# Altium schematic sheet 14 CPU_2.SchDoc
size 420 x 297 mm; Address1: Address1; Address2: Address2; Address3: Address3; Address4: Address4; DocumentNumber: АБВГ.123456.001 Э3; SheetNumber: 14; SheetTotal: 23; Scale: 1:1; DocumentType: Схема электрическая принципиальная; FirstReferrence: АБВГ.123456.001
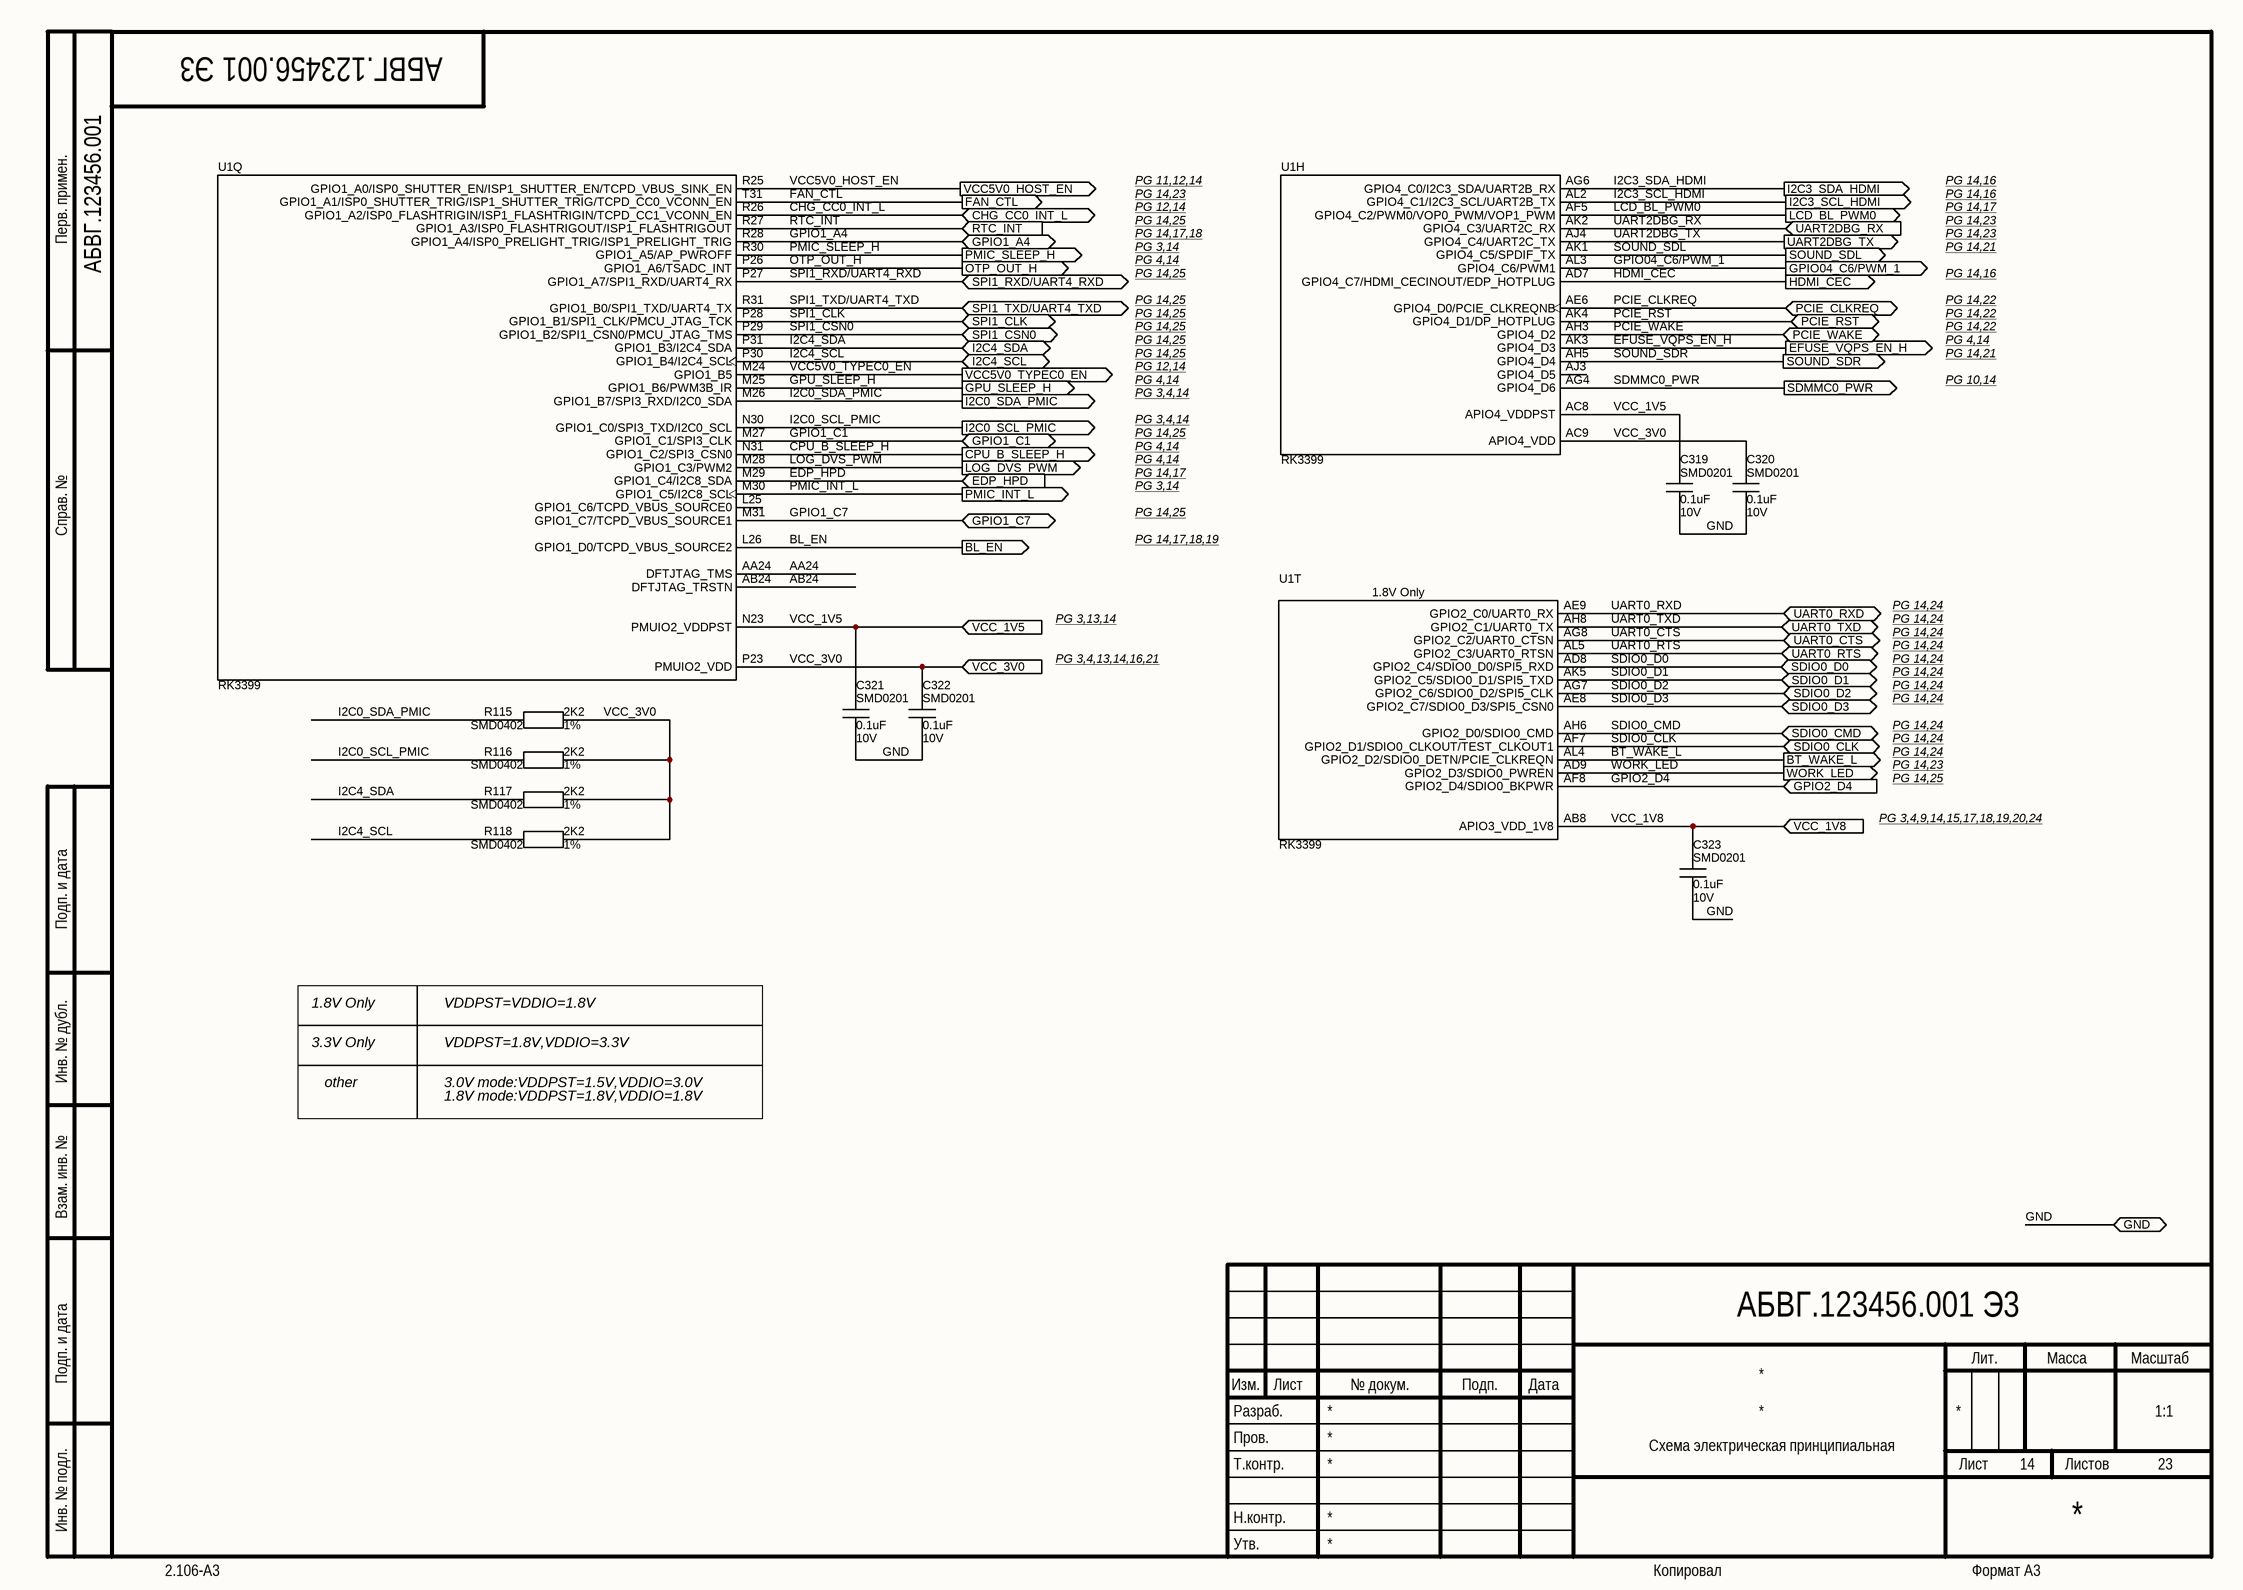
[diagram p0: 14 CPU_2.SchDoc]

## Parts
C319  Package: SMD0201  Voltage: 10V  [CAP_SMD_0201]  (hidden comment: 0.1uF)
C320  Package: SMD0201  Voltage: 10V  [CAP_SMD_0201]  (hidden comment: 0.1uF)
C321  Package: SMD0201  Voltage: 10V  [CAP_SMD_0201]  (hidden comment: 0.1uF)
C322  Package: SMD0201  Voltage: 10V  [CAP_SMD_0201]  (hidden comment: 0.1uF)
C323  Package: SMD0201  Voltage: 10V  [CAP_SMD_0201]  (hidden comment: 0.1uF)
R115  Package: SMD0402  Tolerance: 1%  [RES_SMD_0402]  (hidden comment: 2K2)
R116  Package: SMD0402  Tolerance: 1%  [RES_SMD_0402]  (hidden comment: 2K2)
R117  Package: SMD0402  Tolerance: 1%  [RES_SMD_0402]  (hidden comment: 2K2)
R118  Package: SMD0402  Tolerance: 1%  [RES_SMD_0402]  (hidden comment: 2K2)
U1  value RK3399  [BGA828C65P31X31_2100X2100X161N]  (hidden comment: RK3399_FF)  (parts H,Q,T of 23)

## Ports
BL_EN (out), BT_WAKE_L (out), CHG_CC0_INT_L (bidir), CPU_B_SLEEP_H (out), EDP_HPD (in), EFUSE_VQPS_EN_H (out), FAN_CTL (out), GND (bidir), GPIO1_A4 (bidir), GPIO1_C1 (bidir), GPIO1_C7 (bidir), GPIO2_D4 (in), GPIO04_C6/PWM_1 (out), GPU_SLEEP_H (out), HDMI_CEC (out), I2C0_SCL_PMIC (out), I2C0_SDA_PMIC (out), I2C3_SCL_HDMI (out), I2C3_SDA_HDMI (out), I2C4_SCL (bidir), I2C4_SDA (bidir), LCD_BL_PWM0 (out), LOG_DVS_PWM (out), OTP_OUT_H (out), PCIE_CLKREQ (bidir), PCIE_RST (bidir), PCIE_WAKE (bidir), PMIC_INT_L (out), PMIC_SLEEP_H (out), RTC_INT (in), SDIO0_CLK (bidir), SDIO0_CMD (bidir), SDIO0_D0 (bidir), SDIO0_D1 (bidir), SDIO0_D2 (bidir), SDIO0_D3 (bidir), SDMMC0_PWR (out), SOUND_SDL (out), SOUND_SDR (out), SPI1_CLK (bidir), SPI1_CSN0 (bidir), SPI1_RXD/UART4_RXD (bidir), SPI1_TXD/UART4_TXD (bidir), UART0_CTS (bidir), UART0_RTS (bidir), UART0_RXD (bidir), UART0_TXD (bidir), UART2DBG_RX (in), UART2DBG_TX (out), VCC5V0_HOST_EN (out), VCC5V0_TYPEC0_EN (out), VCC_1V5 (in), VCC_1V8 (in), VCC_3V0 (in), WORK_LED (out)

## Nets
AA24: U1.AA24(DFTJTAG_TMS)
AB24: U1.AB24(DFTJTAG_TRSTN)
BL_EN: U1.L26(GPIO1_D0/TCPD_VBUS_SOURCE2) ; port BL_EN
BT_WAKE_L: U1.AL4(GPIO2_D2/SDIO0_DETN/PCIE_CLKREQN) ; port BT_WAKE_L
CHG_CC0_INT_L: U1.R26(GPIO1_A2/ISP0_FLASHTRIGIN/ISP1_FLASHTRIGIN/TCPD_CC1_VCONN_EN) ; port CHG_CC0_INT_L
CPU_B_SLEEP_H: U1.N31(GPIO1_C2/SPI3_CSN0) ; port CPU_B_SLEEP_H
EDP_HPD: U1.M29(GPIO1_C4/I2C8_SDA) ; port EDP_HPD
EFUSE_VQPS_EN_H: U1.AK3(GPIO4_D3) ; port EFUSE_VQPS_EN_H
FAN_CTL: U1.T31(GPIO1_A1/ISP0_SHUTTER_TRIG/ISP1_SHUTTER_TRIG/TCPD_CC0_VCONN_EN) ; port FAN_CTL
GND: C319.2 C320.2 C321.2 C322.2 C323.2 ; port GND
GPIO1_A4: U1.R28(GPIO1_A4/ISP0_PRELIGHT_TRIG/ISP1_PRELIGHT_TRIG) ; port GPIO1_A4
GPIO1_C1: U1.M27(GPIO1_C1/SPI3_CLK) ; port GPIO1_C1
GPIO1_C7: U1.M31(GPIO1_C7/TCPD_VBUS_SOURCE1) ; port GPIO1_C7
GPIO2_D4: U1.AF8(GPIO2_D4/SDIO0_BKPWR) ; port GPIO2_D4
GPIO04_C6/PWM_1: U1.AL3(GPIO4_C6/PWM1) ; port GPIO04_C6/PWM_1
GPU_SLEEP_H: U1.M25(GPIO1_B6/PWM3B_IR) ; port GPU_SLEEP_H
HDMI_CEC: U1.AD7(GPIO4_C7/HDMI_CECINOUT/EDP_HOTPLUG) ; port HDMI_CEC
I2C0_SCL_PMIC: R116.2 U1.N30(GPIO1_C0/SPI3_TXD/I2C0_SCL) ; port I2C0_SCL_PMIC
I2C0_SDA_PMIC: R115.2 U1.M26(GPIO1_B7/SPI3_RXD/I2C0_SDA) ; port I2C0_SDA_PMIC
I2C3_SCL_HDMI: U1.AL2(GPIO4_C1/I2C3_SCL/UART2B_TX) ; port I2C3_SCL_HDMI
I2C3_SDA_HDMI: U1.AG6(GPIO4_C0/I2C3_SDA/UART2B_RX) ; port I2C3_SDA_HDMI
I2C4_SCL: R118.2 U1.P30(GPIO1_B4/I2C4_SCL) ; port I2C4_SCL
I2C4_SDA: R117.2 U1.P31(GPIO1_B3/I2C4_SDA) ; port I2C4_SDA
LCD_BL_PWM0: U1.AF5(GPIO4_C2/PWM0/VOP0_PWM/VOP1_PWM) ; port LCD_BL_PWM0
LOG_DVS_PWM: U1.M28(GPIO1_C3/PWM2) ; port LOG_DVS_PWM
OTP_OUT_H: U1.P26(GPIO1_A6/TSADC_INT) ; port OTP_OUT_H
PCIE_CLKREQ: U1.AE6(GPIO4_D0/PCIE_CLKREQNB) ; port PCIE_CLKREQ
PCIE_RST: U1.AK4(GPIO4_D1/DP_HOTPLUG) ; port PCIE_RST
PCIE_WAKE: U1.AH3(GPIO4_D2) ; port PCIE_WAKE
PMIC_INT_L: U1.M30(GPIO1_C5/I2C8_SCL) ; port PMIC_INT_L
PMIC_SLEEP_H: U1.R30(GPIO1_A5/AP_PWROFF) ; port PMIC_SLEEP_H
RTC_INT: U1.R27(GPIO1_A3/ISP0_FLASHTRIGOUT/ISP1_FLASHTRIGOUT) ; port RTC_INT
SDIO0_CLK: U1.AF7(GPIO2_D1/SDIO0_CLKOUT/TEST_CLKOUT1) ; port SDIO0_CLK
SDIO0_CMD: U1.AH6(GPIO2_D0/SDIO0_CMD) ; port SDIO0_CMD
SDIO0_D0: U1.AD8(GPIO2_C4/SDIO0_D0/SPI5_RXD) ; port SDIO0_D0
SDIO0_D1: U1.AK5(GPIO2_C5/SDIO0_D1/SPI5_TXD) ; port SDIO0_D1
SDIO0_D2: U1.AG7(GPIO2_C6/SDIO0_D2/SPI5_CLK) ; port SDIO0_D2
SDIO0_D3: U1.AE8(GPIO2_C7/SDIO0_D3/SPI5_CSN0) ; port SDIO0_D3
SDMMC0_PWR: U1.AG4(GPIO4_D6) ; port SDMMC0_PWR
SOUND_SDL: U1.AK1(GPIO4_C5/SPDIF_TX) ; port SOUND_SDL
SOUND_SDR: U1.AH5(GPIO4_D4) ; port SOUND_SDR
SPI1_CLK: U1.P28(GPIO1_B1/SPI1_CLK/PMCU_JTAG_TCK) ; port SPI1_CLK
SPI1_CSN0: U1.P29(GPIO1_B2/SPI1_CSN0/PMCU_JTAG_TMS) ; port SPI1_CSN0
SPI1_RXD/UART4_RXD: U1.P27(GPIO1_A7/SPI1_RXD/UART4_RX) ; port SPI1_RXD/UART4_RXD
SPI1_TXD/UART4_TXD: U1.R31(GPIO1_B0/SPI1_TXD/UART4_TX) ; port SPI1_TXD/UART4_TXD
UART0_CTS: U1.AG8(GPIO2_C2/UART0_CTSN) ; port UART0_CTS
UART0_RTS: U1.AL5(GPIO2_C3/UART0_RTSN) ; port UART0_RTS
UART0_RXD: U1.AE9(GPIO2_C0/UART0_RX) ; port UART0_RXD
UART0_TXD: U1.AH8(GPIO2_C1/UART0_TX) ; port UART0_TXD
UART2DBG_RX: U1.AK2(GPIO4_C3/UART2C_RX) ; port UART2DBG_RX
UART2DBG_TX: U1.AJ4(GPIO4_C4/UART2C_TX) ; port UART2DBG_TX
VCC5V0_HOST_EN: U1.R25(GPIO1_A0/ISP0_SHUTTER_EN/ISP1_SHUTTER_EN/TCPD_VBUS_SINK_EN) ; port VCC5V0_HOST_EN
VCC5V0_TYPEC0_EN: U1.M24(GPIO1_B5) ; port VCC5V0_TYPEC0_EN
VCC_1V5: C319.1 C321.1 U1.AC8(APIO4_VDDPST) U1.N23(PMUIO2_VDDPST) ; port VCC_1V5
VCC_1V8: C323.1 U1.AB8(APIO3_VDD_1V8) ; port VCC_1V8
VCC_3V0: C320.1 C322.1 R115.1 R116.1 R117.1 R118.1 U1.AC9(APIO4_VDD) U1.P23(PMUIO2_VDD) ; port VCC_3V0
WORK_LED: U1.AD9(GPIO2_D3/SDIO0_PWREN) ; port WORK_LED

Not connected (* = marked no-connect by the designer): U1 AJ3(GPIO4_D5) L25(GPIO1_C6/TCPD_VBUS_SOURCE0)

## Notes on the sheet
- PG 11,12,14
- PG 14,16
- Перв. примен.
- PG 3,14
- PG 12,14
- PG 14,17,18
- PG 14,23
- PG 14,25
- PG 14,17
- PG 14,21
- PG 4,14
- PG 14,22
- PG 3,4,14
- PG 10,14
- Справ. №
- PG 14,17,18,19
- PG 3,13,14
- PG 3,4,13,14,16,21
- PG 14,24
- PG 3,4,9,14,15,17,18,19,20,24
- Подп. и дата
- 1.8V Only
- 3.3V Only
- VDDPST=VDDIO=1.8V
- VDDPST=1.8V,VDDIO=3.3V
- Инв. № дубл.
- other
- 3.0V mode:VDDPST=1.5V,VDDIO=3.0V
- 1.8V mode:VDDPST=1.8V,VDDIO=1.8V
- Взам. инв. №
- Разраб.
- Изм.
- Лист
- № докум.
- Подп.
- Дата
- Лит.
- Масса
- Масштаб
- Пров.
- Т.контр.
- Листов
- Инв. № подл.
- Утв.
- Н.контр.
- 2.106-A3
- Копировал
- Формат А3
- (in symbol RK3399_FF, part T) 1.8V Only

## Library data of the parts
C319-C323 = Ceramic_Cap: PartNumber: CC0201KRX5R6BB104; ComponentType: SMD Ceramic Chip Capacitor; Manufacter: *; Tolerance: *; ClassName: *; Value: 0.1uF
R115-R118 = Chip_Res: PartNumber: RC0402FR-072K2L; ComponentType: SMD Chip Resistor; Manufacter: *; Voltage: *; ClassName: *; Value: 2K2
U1 = RK3399_FF: Package: BGA828; ComponentType: *; Manufacter: *; PartNumber: RK3399; ClassName: *